# EAGLE schematic EEZ DIB MIO168 r2B5 (EAGLE 7.2.0)
Assembly variants: Farnell, TME

## Sheet 1 of 6: DIB interface
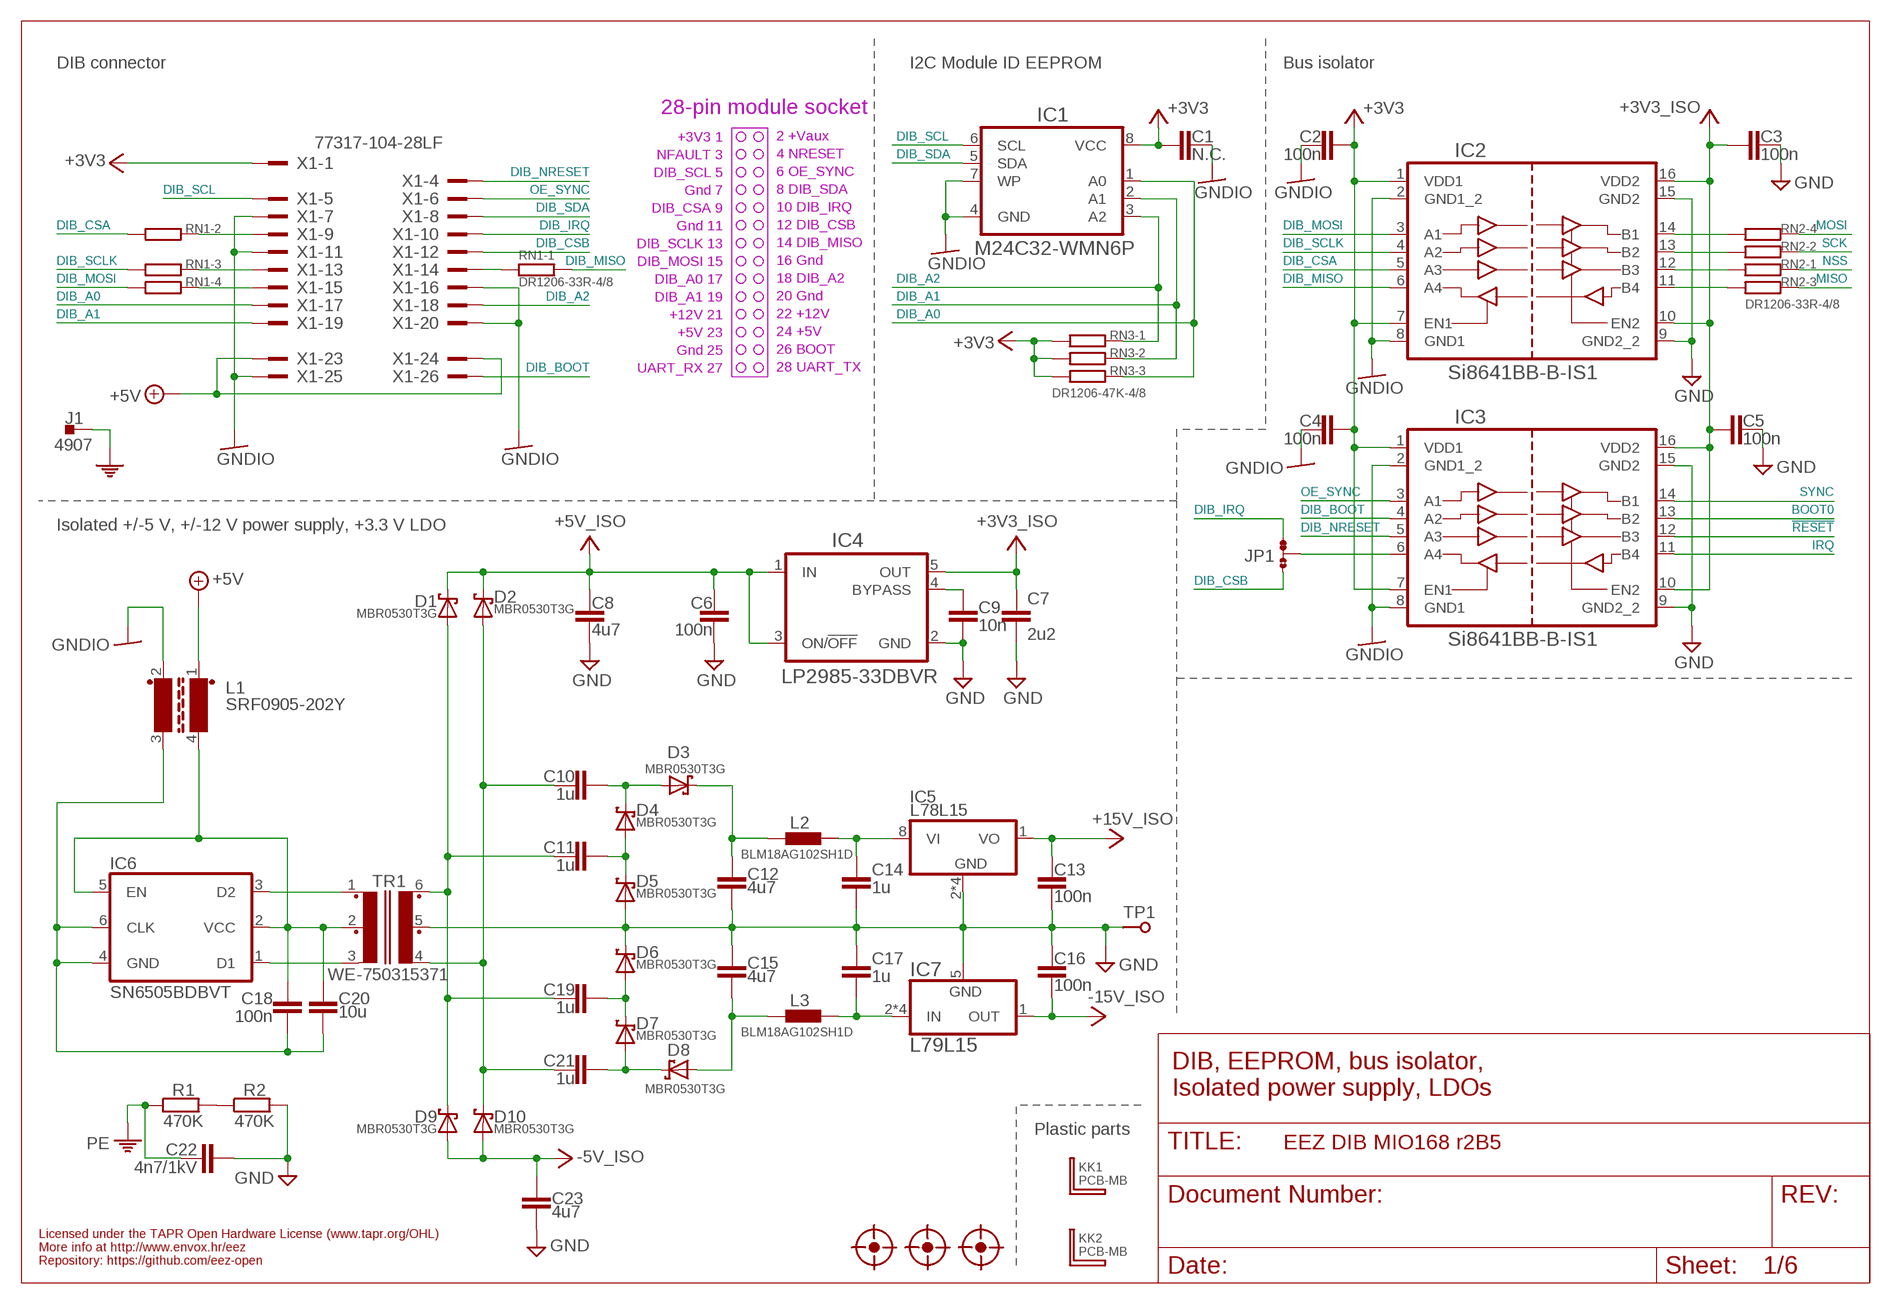
[diagram p0: schematic, sheet 1]

### Parts
C1  N.C.  C-EUC0603  [C0603]
C2  100n  C-EUC0603  [C0603]
C3  100n  C-EUC0603  [C0603]
C4  100n  C-EUC0603  [C0603]
C5  100n  C-EUC0603  [C0603]
C6  100n  C-EUC0603  [C0603]
C7  2u2  C-EUC0805  [C0805]
C8  4u7  C-EUC0805  [C0805]
C9  10n  C-EUC0805  [C0805]
C10  1u  C-EUC0805  [C0805]
C11  1u  C-EUC0805  [C0805]
C12  4u7  C-EUC0805  [C0805]
C13  100n  C-EUC0603  [C0603]
C14  1u  C-EUC0805  [C0805]
C15  4u7  C-EUC0805  [C0805]
C16  100n  C-EUC0603  [C0603]
C17  1u  C-EUC0805  [C0805]
C18  100n  C-EUC0603  [C0603]
C19  1u  C-EUC0805  [C0805]
C20  10u  C-EUC1206  [C1206]
C21  1u  C-EUC0805  [C0805]
C22  4n7/1kV  C-EUC1812  [C1812]
C23  4u7  C-EUC0805  [C0805]
D1  MBR0530T3G  SCHOTTKYSOD123  [SOD123]
D2  MBR0530T3G  SCHOTTKYSOD123  [SOD123]
D3  MBR0530T3G  SCHOTTKYSOD123  [SOD123]
D4  MBR0530T3G  SCHOTTKYSOD123  [SOD123]
D5  MBR0530T3G  SCHOTTKYSOD123  [SOD123]
D6  MBR0530T3G  SCHOTTKYSOD123  [SOD123]
D7  MBR0530T3G  SCHOTTKYSOD123  [SOD123]
D8  MBR0530T3G  SCHOTTKYSOD123  [SOD123]
D9  MBR0530T3G  SCHOTTKYSOD123  [SOD123]
D10  MBR0530T3G  SCHOTTKYSOD123  [SOD123]
FM1  FIDUCIAL_2  [FIDUCIAL_DUAL]
FM2  FIDUCIAL_2  [FIDUCIAL_DUAL]
FM3  FIDUCIAL_2  [FIDUCIAL_DUAL]
IC1  M24C32-WMN6P  AT24CXXSOIC8  [SOIC127P600X173-8N]
IC2  Si8641BB-B-IS1  SI8641NSOIC-16  [SOIC-16]
IC3  Si8641BB-B-IS1  SI8641NSOIC-16  [SOIC-16]
IC4  LP2985-33DBVR  LP2985  [SOT95P270X145-5N]
IC5  L78L15  MC78LXXSOIC8  [SOIC127P600X173-8N]
IC6  SN6505BDBVT  [DBV0006A_N]
IC7  L79L15  MC79LXXSOIC  [SOIC127P600X173-8N]
J1  4907  PCB_TAB-4907  [PCB_TAB-4907]
JP1  JP3-CUT-0805-ROTATED  [JP3-0805-CUT2]
KK1  PCB-MB  [PCB-MB]
KK2  PCB-MB  [PCB-MB]
L1  SRF0905-202Y  SRF0905  [SRF0905]
L2  BLM18AG102SH1D  FERRITE_BEAD0603  [BEAD0603]
L3  BLM18AG102SH1D  FERRITE_BEAD0603  [BEAD0603]
R1  470K  R-EU_R0805  [R0805]
R2  470K  R-EU_R0805  [R0805]
RN1  DR1206-33R-4/8  R_ARRAY4  [CAY16]
RN2  DR1206-33R-4/8  R_ARRAY4  [CAY16]
RN3  DR1206-47K-4/8  R_ARRAY4  [CAY16]
TP1  PCB_TEST_TABSHIELD  [PCB_SHIELD_TAB]
TR1  WE-750315371  MURATA_78615  [MURATA_78615]
X1  77317-104-28LF  [77317-104-28LF]

### Nets
!RESET: IC3.12(B3) ; also sheet 2,4,6
+3V3: C1.2 C2.1 C4.1 IC1.8(VCC) IC2.1(VDD1) IC2.7(EN1) IC3.1(VDD1) IC3.7(EN1) RN3.6 RN3.7 RN3.8 X1.1
+3V3_ISO: C3.2 C5.2 C7.1 IC2.10(EN2) IC2.16(VDD2) IC3.10(EN2) IC3.16(VDD2) IC4.5(OUT) ; also sheet 2,3,4,5,6
+5V: L1.1 X1.23 X1.24
+5V_ISO: C6.1 C8.2 D1.C D2.C IC4.1(IN) IC4.3(ON/!OFF) ; also sheet 6
+15V_ISO: C13.1 IC5.1(VO) ; also sheet 3,4,6
-5V_ISO: C23.2 D9.A D10.A ; also sheet 6
-15V_IN: C17.1 IC7.2(IN) IC7.3(IN) IC7.6(IN) IC7.7(IN) L3.P$2
-15V_ISO: C16.2 IC7.1(OUT) ; also sheet 3,4,6
BOOT0: IC3.13(B2) ; also sheet 2
DIB_A0: IC1.1(A0) RN3.3 X1.17
DIB_A1: IC1.2(A1) RN3.2 X1.19
DIB_A2: IC1.3(A2) RN3.1 X1.18
DIB_BOOT: IC3.4(A2) X1.26
DIB_CSA: IC2.5(A3) RN1.2
DIB_CSB: JP1.NO X1.12
DIB_IRQ: JP1.NC X1.10
DIB_MISO: IC2.6(A4) RN1.1
DIB_MOSI: IC2.3(A1) RN1.4
DIB_NRESET: IC3.5(A3) X1.4
DIB_SCL: IC1.6(SCL) X1.5
DIB_SCLK: IC2.4(A2) RN1.3
DIB_SDA: IC1.5(SDA) X1.8
GND: C3.1 C5.1 C6.2 C7.2 C8.1 C9.1 C12.2 C13.2 C14.1 C15.1 C16.1 C17.2 C22.2 C23.1 D5.A D6.C IC2.9(GND2_2) IC2.15(GND2) IC3.9(GND2_2) IC3.15(GND2) IC4.2(GND) IC5.2(GND) IC5.3(GND) IC5.6(GND) IC5.7(GND) IC7.5(GND) R2.2 TP1.1 TR1.5 ; also sheet 2,3,4,5,6
GNDIO: C1.1 C2.2 C4.2 IC1.4(GND) IC1.7(WP) IC2.2(GND1_2) IC2.8(GND1) IC3.2(GND1_2) IC3.8(GND1) L1.2 X1.7 X1.11 X1.16 X1.20 X1.25
IRQ: IC3.11(B4) ; also sheet 2
MISO: RN2.6 ; also sheet 2
MOSI: RN2.5 ; also sheet 2
N$11: IC3.6(A4) JP1.COM
N$12: IC2.14(B1) RN2.4
N$21: R1.2 R2.1
N$52: C11.1 D4.A D5.C
N$53: IC6.3(D2) TR1.1
N$63: IC6.1(D1) TR1.3
N$64: C11.2 C19.2 D1.A D9.C TR1.6
N$69: RN1.7 X1.9
N$70: C10.2 C21.2 D2.A D10.C TR1.4
N$72: IC2.11(B4) RN2.3
N$79: C10.1 D3.A D4.C
N$99: RN1.6 X1.13
N$101: RN1.8 X1.14
N$102: RN1.5 X1.15
N$104: C19.1 D6.A D7.C
N$105: C21.1 D7.A D8.C
N$106: C9.2 IC4.4(BYPASS)
N$111: C14.2 IC5.8(VI) L2.P$2
N$116: IC2.13(B2) RN2.2
N$118: IC2.12(B3) RN2.1
N$167: C15.2 D8.A L3.P$1
N$169: C12.1 D3.C L2.P$1
NSS: RN2.8 ; also sheet 2
OE_SYNC: IC3.3(A1) X1.6
PE: C22.1 J1.1 J1.2 R1.1
SCK: RN2.7 ; also sheet 2
SN_GND: C18.2 C20.1 IC6.4(GND) IC6.6(CLK) L1.3
SN_VCC: C18.1 C20.2 IC6.2(VCC) IC6.5(EN) L1.4 TR1.2
SYNC: IC3.14(B1) ; also sheet 2
Unconnected: RN3.4 RN3.5 X1.2 X1.3 X1.21 X1.22 X1.27 X1.28

### Notes on the sheet
- DIB connector | I2C Module ID EEPROM | Bus isolator
- 28-pin module socket
- +3V3 1
- 2 +Vaux
- NFAULT 3
- 4 NRESET
- DIB_SCL 5
- 6 OE_SYNC
- Gnd 7
- 8 DIB_SDA
- DIB_CSA 9
- 10 DIB_IRQ
- Gnd 11
- 12 DIB_CSB
- DIB_SCLK 13
- 14 DIB_MISO
- DIB_MOSI 15
- 16 Gnd
- DIB_A0 17
- 18 DIB_A2
- DIB_A1 19
- 20 Gnd
- +12V 21
- 22 +12V
- +5V 23
- 24 +5V
- Gnd 25
- 26 BOOT
- UART_RX 27
- 28 UART_TX
- Isolated +/-5 V, +/-12 V power supply, +3.3 V LDO
- DIB, EEPROM, bus isolator,
  Isolated power supply, LDOs
- Plastic parts
- Licensed under the TAPR Open Hardware License (www.tapr.org/OHL)
- More info at http://www.envox.hr/eez
- Repository: https://github.com/eez-open

## Sheet 2 of 6: MCU
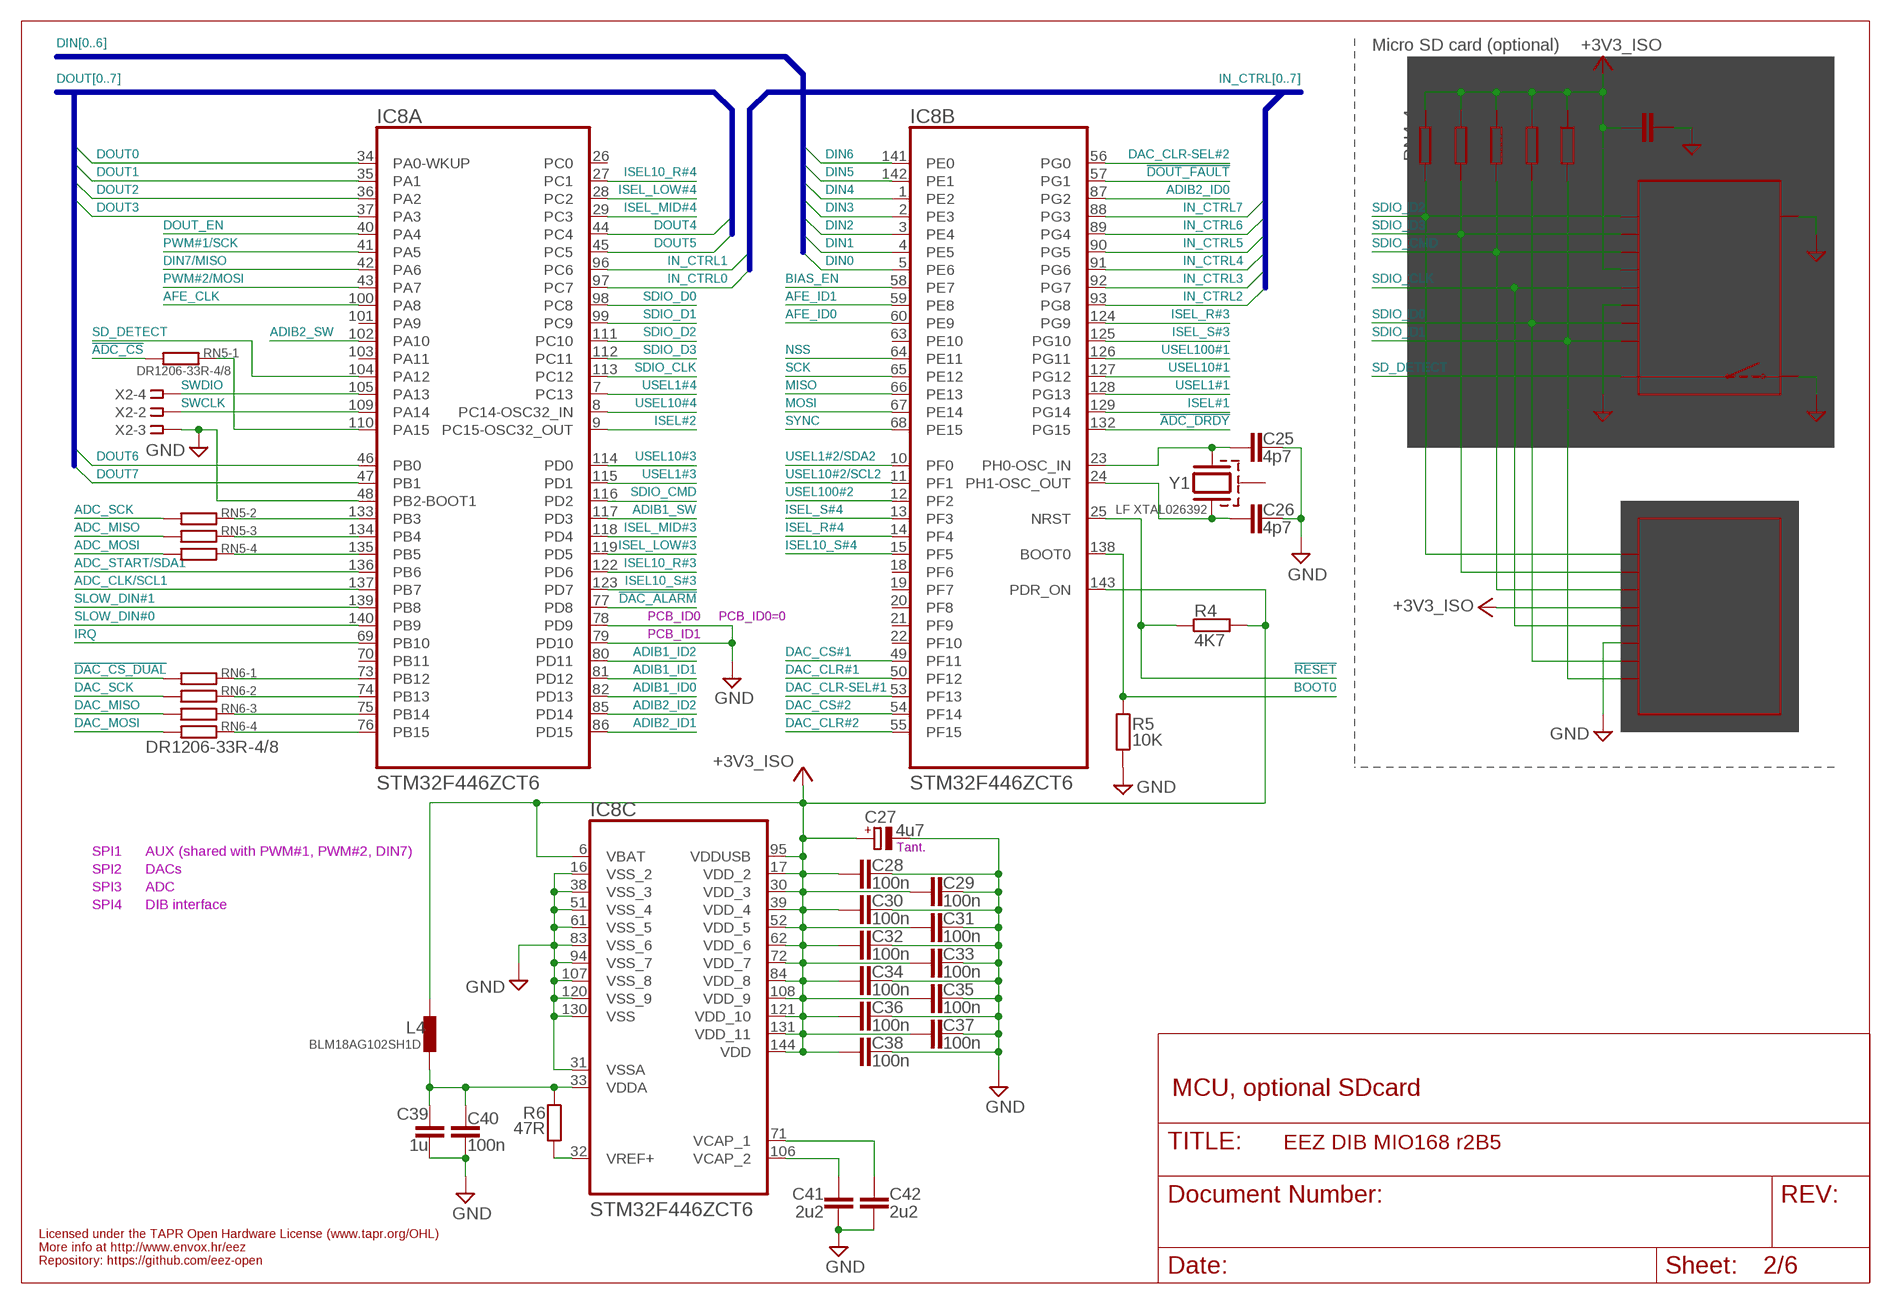
[diagram p1: schematic, sheet 2]

### Parts
C24  N.C.  C-EUC0805  [C0805]
C25  4p7  C-EUC0603  [C0603]
C26  4p7  C-EUC0603  [C0603]
C27  4u7  ECAP1206  [EC1206]
C28  100n  C-EUC0603  [C0603]
C29  100n  C-EUC0603  [C0603]
C30  100n  C-EUC0603  [C0603]
C31  100n  C-EUC0603  [C0603]
C32  100n  C-EUC0603  [C0603]
C33  100n  C-EUC0603  [C0603]
C34  100n  C-EUC0603  [C0603]
C35  100n  C-EUC0603  [C0603]
C36  100n  C-EUC0603  [C0603]
C37  100n  C-EUC0603  [C0603]
C38  100n  C-EUC0603  [C0603]
C39  1u  C-EUC0805  [C0805]
C40  100n  C-EUC0603  [C0603]
C41  2u2  C-EUC0805  [C0805]
C42  2u2  C-EUC0805  [C0805]
IC8  STM32F446ZCT6  [LQFP-144]
IC9  N.C.  XTSD0XG  [LGA8]
J2  N.C.  5033981892  [5033981892]
L4  BLM18AG102SH1D  FERRITE_BEAD0603  [BEAD0603]
R3  N.C.  R-EU_R0805  [R0805]
R4  4K7  R-EU_R0805  [R0805]
R5  10K  R-EU_R0805  [R0805]
R6  47R  R-EU_R0805  [R0805]
RN4  N.C.  R_ARRAY4  [CAY16]
RN5  DR1206-33R-4/8  R_ARRAY4  [CAY16]
RN6  DR1206-33R-4/8  R_ARRAY4  [CAY16]
X2  N.C.  SSW-106-02-S-S  [SSW-106-02-S-S]
Y1  LF XTAL026392  12SMX-B  [12SMX(B)]

### Nets
!ADC_CS: RN5.1 ; also sheet 6
!ADC_DRDY: IC8.132(B:PG15) ; also sheet 6
!DAC_ALARM: IC8.77(A:PD8) ; also sheet 3
!DAC_CS_DUAL: RN6.1 ; also sheet 4
!DOUT_FAULT: IC8.57(B:PG1) ; also sheet 4
!RESET: IC8.25(B:NRST) R4.2 ; also sheet 1,4,6
+3V3_ISO: C24.1 C27.+ C28.1 C29.1 C30.1 C31.1 C32.1 C33.1 C34.1 C35.1 C36.1 C37.1 C38.1 IC8.6(C:VBAT) IC8.17(C:VDD_2) IC8.30(C:VDD_3) IC8.39(C:VDD_4) IC8.52(C:VDD_5) IC8.62(C:VDD_6) IC8.72(C:VDD_7) IC8.84(C:VDD_8) IC8.95(C:VDDUSB) IC8.108(C:VDD_9) IC8.121(C:VDD_10) IC8.131(C:VDD_11) IC8.143(B:PDR_ON) IC8.144(C:VDD) IC9.8(VDD) J2.4(VDD) L4.P$1 R3.1 R4.1 RN4.1 RN4.2 RN4.3 RN4.4 ; also sheet 1,3,4,5,6
ADC_CLK/SCL1: IC8.137(A:PB7) ; also sheet 6
ADC_MISO: RN5.3 ; also sheet 6
ADC_MOSI: RN5.4 ; also sheet 6
ADC_SCK: RN5.2 ; also sheet 6
ADC_START/SDA1: IC8.136(A:PB6) ; also sheet 6
ADIB1_ID0: IC8.82(A:PD13) ; also sheet 6
ADIB1_ID1: IC8.81(A:PD12) ; also sheet 6
ADIB1_ID2: IC8.80(A:PD11) ; also sheet 6
ADIB1_SW: IC8.117(A:PD3) ; also sheet 6
ADIB2_ID0: IC8.87(B:PG2) ; also sheet 6
ADIB2_ID1: IC8.86(A:PD15) ; also sheet 6
ADIB2_ID2: IC8.85(A:PD14) ; also sheet 6
ADIB2_SW: IC8.102(A:PA10) ; also sheet 6
AFE_CLK: IC8.100(A:PA8) ; also sheet 6
AFE_ID0: IC8.60(B:PE9) ; also sheet 6
AFE_ID1: IC8.59(B:PE8) ; also sheet 6
BIAS_EN: IC8.58(B:PE7) ; also sheet 6
BOOT0: IC8.138(B:BOOT0) R5.2 ; also sheet 1
DAC_CLR#1: IC8.50(B:PF12) ; also sheet 3
DAC_CLR#2: IC8.55(B:PF15) ; also sheet 3
DAC_CLR-SEL#1: IC8.53(B:PF13) ; also sheet 3
DAC_CLR-SEL#2: IC8.56(B:PG0) ; also sheet 3
DAC_CS#1: IC8.49(B:PF11) ; also sheet 3
DAC_CS#2: IC8.54(B:PF14) ; also sheet 3
DAC_MISO: RN6.3 ; also sheet 3
DAC_MOSI: RN6.4 ; also sheet 3,4
DAC_SCK: RN6.2 ; also sheet 3,4
DIN0: IC8.5(B:PE6) ; also sheet 5
DIN1: IC8.4(B:PE5) ; also sheet 5
DIN2: IC8.3(B:PE4) ; also sheet 5
DIN3: IC8.2(B:PE3) ; also sheet 5
DIN4: IC8.1(B:PE2) ; also sheet 5
DIN5: IC8.142(B:PE1) ; also sheet 5
DIN6: IC8.141(B:PE0) ; also sheet 5
DIN7/MISO: IC8.42(A:PA6) ; also sheet 5
DOUT0: IC8.34(A:PA0-WKUP) ; also sheet 4
DOUT1: IC8.35(A:PA1) ; also sheet 4
DOUT2: IC8.36(A:PA2) ; also sheet 4
DOUT3: IC8.37(A:PA3) ; also sheet 4
DOUT4: IC8.44(A:PC4) ; also sheet 4
DOUT5: IC8.45(A:PC5) ; also sheet 4
DOUT6: IC8.46(A:PB0) ; also sheet 4
DOUT7: IC8.47(A:PB1) ; also sheet 4
DOUT_EN: IC8.40(A:PA4) ; also sheet 4,6
GND: C24.2 C25.1 C26.1 C27.- C28.2 C29.2 C30.2 C31.2 C32.2 C33.2 C34.2 C35.2 C36.2 C37.2 C38.2 C39.2 C40.2 C41.1 C42.1 IC8.16(C:VSS_2) IC8.31(C:VSSA) IC8.38(C:VSS_3) IC8.48(A:PB2-BOOT1) IC8.51(C:VSS_4) IC8.61(C:VSS_5) IC8.78(A:PD9) IC8.79(A:PD10) IC8.83(C:VSS_6) IC8.94(C:VSS_7) IC8.107(C:VSS_8) IC8.120(C:VSS_9) IC8.130(C:VSS) IC9.4(VSS) J2.6(VSS) J2.S1(SH) J2.S2(SH) J2.S(SH) J2.SW2 R5.1 X2.3 ; also sheet 1,3,4,5,6
IN_CTRL0: IC8.97(A:PC7) ; also sheet 5
IN_CTRL1: IC8.96(A:PC6) ; also sheet 5
IN_CTRL2: IC8.93(B:PG8) ; also sheet 5
IN_CTRL3: IC8.92(B:PG7) ; also sheet 5
IN_CTRL4: IC8.91(B:PG6) ; also sheet 5
IN_CTRL5: IC8.90(B:PG5) ; also sheet 5
IN_CTRL6: IC8.89(B:PG4) ; also sheet 5
IN_CTRL7: IC8.88(B:PG3) ; also sheet 5
IRQ: IC8.69(A:PB10) ; also sheet 1
ISEL10_R#3: IC8.122(A:PD6) ; also sheet 6
ISEL10_R#4: IC8.27(A:PC1) ; also sheet 6
ISEL10_S#3: IC8.123(A:PD7) ; also sheet 6
ISEL10_S#4: IC8.15(B:PF5) ; also sheet 6
ISEL#1: IC8.129(B:PG14) ; also sheet 6
ISEL#2: IC8.9(A:PC15-OSC32_OUT) ; also sheet 6
ISEL_LOW#3: IC8.119(A:PD5) ; also sheet 6
ISEL_LOW#4: IC8.28(A:PC2) ; also sheet 6
ISEL_MID#3: IC8.118(A:PD4) ; also sheet 6
ISEL_MID#4: IC8.29(A:PC3) ; also sheet 6
ISEL_R#3: IC8.124(B:PG9) ; also sheet 6
ISEL_R#4: IC8.14(B:PF4) ; also sheet 6
ISEL_S#3: IC8.125(B:PG10) ; also sheet 6
ISEL_S#4: IC8.13(B:PF3) ; also sheet 6
MISO: IC8.66(B:PE13) ; also sheet 1
MOSI: IC8.67(B:PE14) ; also sheet 1
N$27: IC8.110(A:PA15) RN5.8
N$29: IC8.133(A:PB3) RN5.7
N$34: IC8.134(A:PB4) RN5.6
N$97: C41.2 IC8.106(C:VCAP_2)
N$100: IC8.135(A:PB5) RN5.5
N$113: C42.2 IC8.71(C:VCAP_1)
N$115: C39.1 C40.1 IC8.33(C:VDDA) L4.P$2 R6.1
N$121: IC8.32(C:VREF+) R6.2
N$176: IC8.73(A:PB12) RN6.8
N$177: IC8.74(A:PB13) RN6.7
N$178: IC8.75(A:PB14) RN6.6
N$179: IC8.76(A:PB15) RN6.5
NSS: IC8.64(B:PE11) ; also sheet 1
PWM#1/SCK: IC8.41(A:PA5) ; also sheet 6
PWM#2/MOSI: IC8.43(A:PA7) ; also sheet 6
RCC_OSC_IN: C25.2 IC8.23(B:PH0-OSC_IN) Y1.3
RCC_OSC_OUT: C26.2 IC8.24(B:PH1-OSC_OUT) Y1.1
SCK: IC8.65(B:PE12) ; also sheet 1
SD_DETECT: IC8.104(A:PA12) J2.SW1
SDIO_CLK: IC8.113(A:PC12) IC9.3(CLK) J2.5(CLK)
SDIO_CMD: IC8.116(A:PD2) IC9.5(CMD) J2.3(CMD) RN4.7
SDIO_D0: IC8.98(A:PC8) IC9.6(DAT0) J2.7(DAT0) RN4.8
SDIO_D1: IC8.99(A:PC9) IC9.7(DAT1) J2.8(DAT1) R3.2
SDIO_D2: IC8.111(A:PC10) IC9.1(DAT2) J2.1(DAT2) RN4.5
SDIO_D3: IC8.112(A:PC11) IC9.2(CD/DAT3) J2.2(CD/DAT3) RN4.6
SLOW_DIN#0: IC8.140(A:PB9) ; also sheet 5
SLOW_DIN#1: IC8.139(A:PB8) ; also sheet 5
SWCLK: IC8.109(A:PA14) X2.2
SWDIO: IC8.105(A:PA13) X2.4
SYNC: IC8.68(B:PE15) ; also sheet 1
USEL1#1: IC8.128(B:PG13) ; also sheet 6
USEL1#2/SDA2: IC8.10(B:PF0) ; also sheet 6
USEL1#3: IC8.115(A:PD1) ; also sheet 6
USEL1#4: IC8.7(A:PC13) ; also sheet 6
USEL10#1: IC8.127(B:PG12) ; also sheet 6
USEL10#2/SCL2: IC8.11(B:PF1) ; also sheet 6
USEL10#3: IC8.114(A:PD0) ; also sheet 6
USEL10#4: IC8.8(A:PC14-OSC32_IN) ; also sheet 6
USEL100#1: IC8.126(B:PG11) ; also sheet 6
USEL100#2: IC8.12(B:PF2) ; also sheet 6
Unconnected: IC8.18(B:PF6) IC8.19(B:PF7) IC8.20(B:PF8) IC8.21(B:PF9) IC8.22(B:PF10) IC8.26(A:PC0) IC8.63(B:PE10) IC8.70(A:PB11) IC8.101(A:PA9) IC8.103(A:PA11) X2.1 X2.5 X2.6 Y1.2(GND) Y1.4(GND)

### Buses
DIN[0..6]
DOUT[0..7]
IN_CTRL[0..7]

### Notes on the sheet
- Micro SD card (optional)
- PCB_ID0 | PCB_ID0=0
- PCB_ID1
- Tant.
- SPI1 | AUX (shared with PWM#1, PWM#2, DIN7)
- SPI2 | DACs
- SPI3 | ADC
- SPI4 | DIB interface
- MCU, optional SDcard
- Licensed under the TAPR Open Hardware License (www.tapr.org/OHL)
- More info at http://www.envox.hr/eez
- Repository: https://github.com/eez-open

## Sheet 3 of 6: Voltage/current DACs
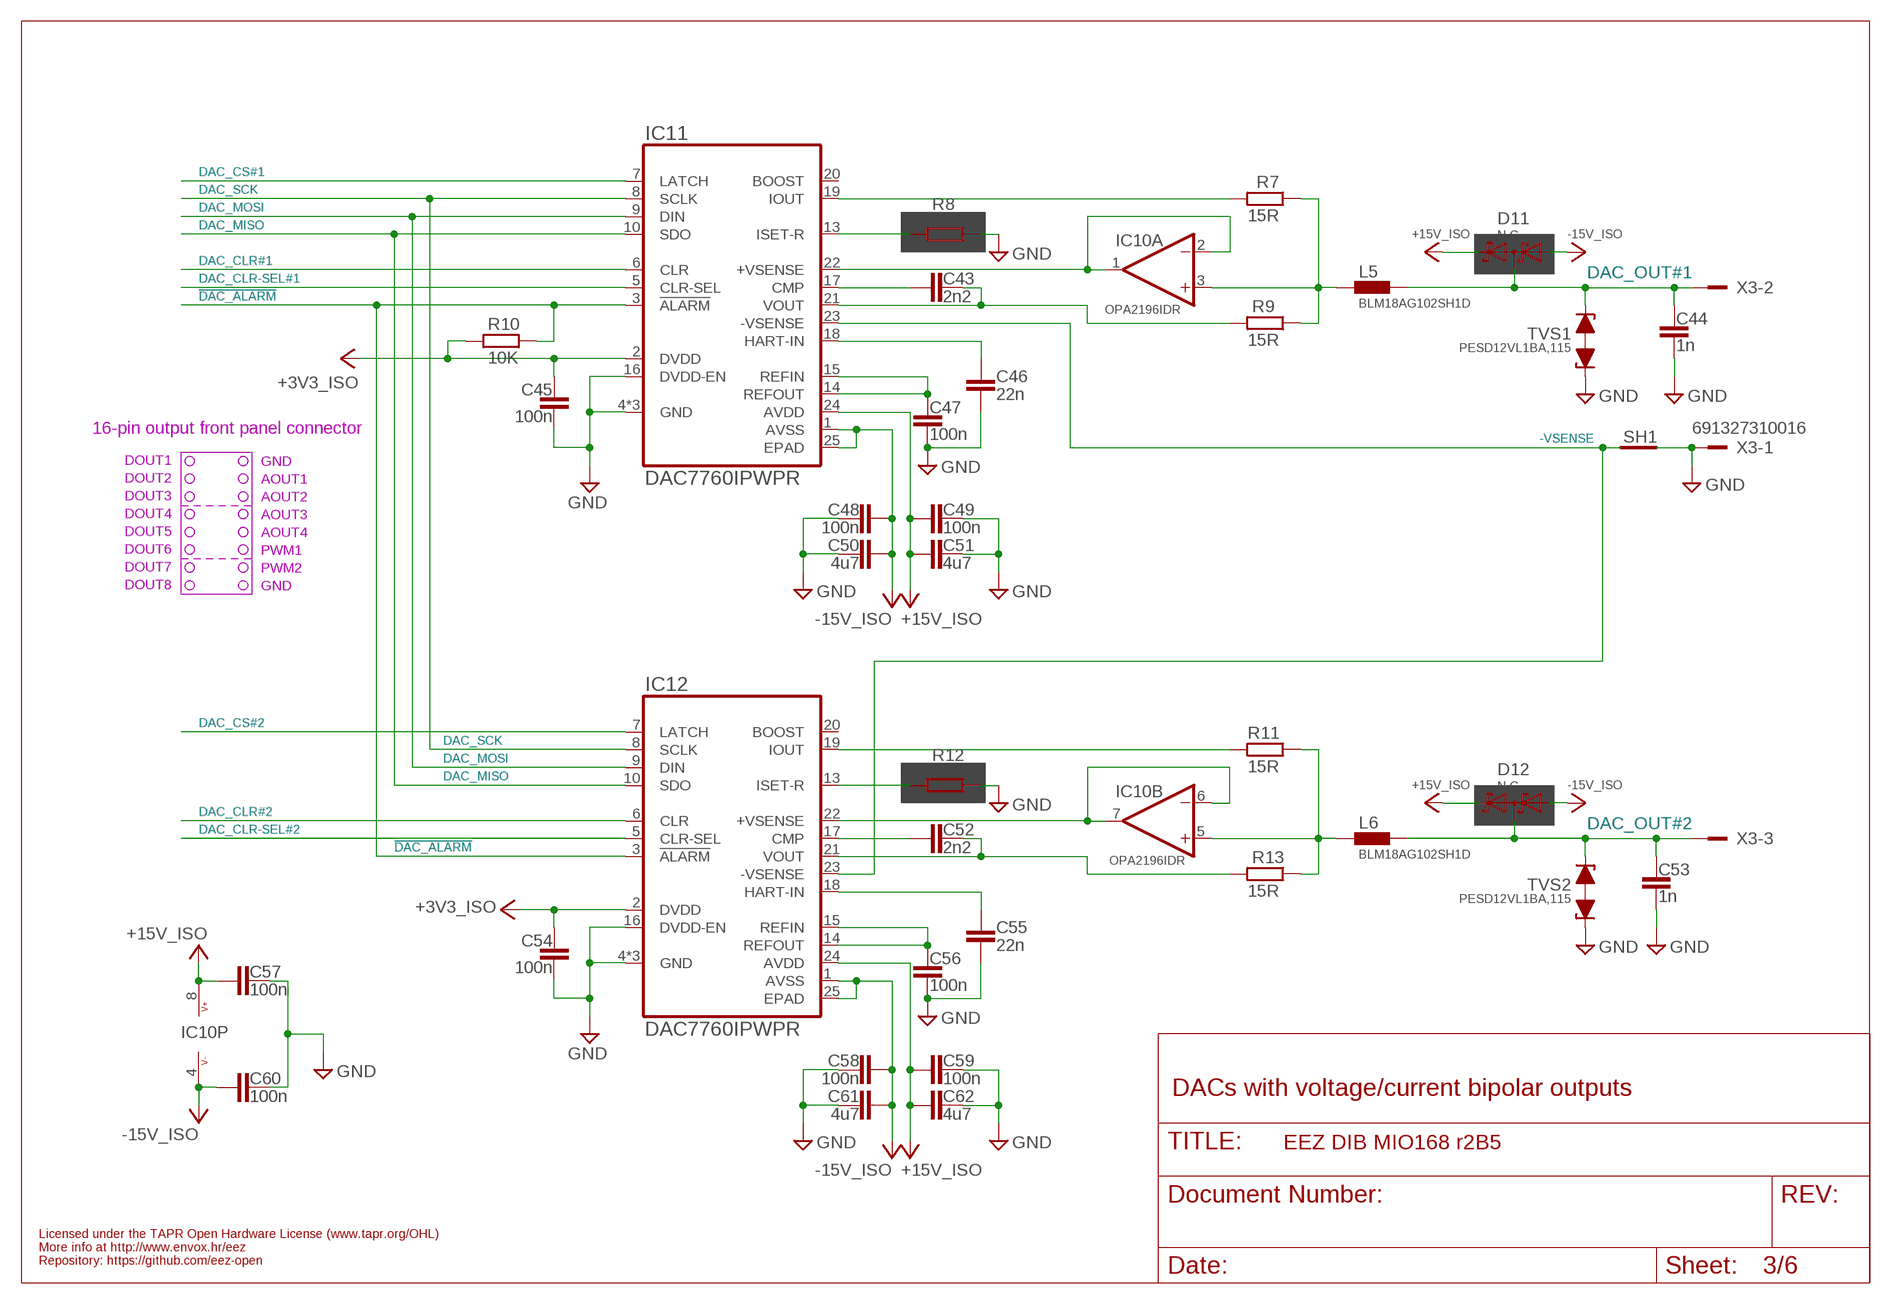
[diagram p2: schematic, sheet 3]

### Parts
C43  2n2  C-EUC0805  [C0805]
C44  1n  C-EUC0805  [C0805]
C45  100n  C-EUC0603  [C0603]
C46  22n  C-EUC0805  [C0805]
C47  100n  C-EUC0603  [C0603]
C48  100n  C-EUC0603  [C0603]
C49  100n  C-EUC0603  [C0603]
C50  4u7  C-EUC0805  [C0805]
C51  4u7  C-EUC0805  [C0805]
C52  2n2  C-EUC0805  [C0805]
C53  1n  C-EUC0805  [C0805]
C54  100n  C-EUC0603  [C0603]
C55  22n  C-EUC0805  [C0805]
C56  100n  C-EUC0603  [C0603]
C57  100n  C-EUC0603  [C0603]
C58  100n  C-EUC0603  [C0603]
C59  100n  C-EUC0603  [C0603]
C60  100n  C-EUC0603  [C0603]
C61  4u7  C-EUC0805  [C0805]
C62  4u7  C-EUC0805  [C0805]
D11  N.C.  BAT54S  [SOT23]
D12  N.C.  BAT54S  [SOT23]
IC10  OPA2196IDR  TL072SOIC8  [SOIC127P600X173-8N]
IC11  DAC7760IPWPR  [PWP24]
IC12  DAC7760IPWPR  [PWP24]
L5  BLM18AG102SH1D  FERRITE_BEAD0603  [BEAD0603]
L6  BLM18AG102SH1D  FERRITE_BEAD0603  [BEAD0603]
R7  15R  R-EU_R0805  [R0805]
R8  N.C.  R-EU_R0805  [R0805]
R9  15R  R-EU_R0805  [R0805]
R10  10K  R-EU_R0805  [R0805]
R11  15R  R-EU_R0805  [R0805]
R12  N.C.  R-EU_R0805  [R0805]
R13  15R  R-EU_R0805  [R0805]
SH1  SHORTNOHOLE  [SHORT_NOHOLE]
TVS1  PESD12VL1BA,115  PESDXL1BA  [SOD323-BIDIR]
TVS2  PESD12VL1BA,115  PESDXL1BA  [SOD323-BIDIR]
X3  691327310016  [691327310016]

### Nets
!DAC_ALARM: IC11.3(!ALARM) IC12.3(!ALARM) R10.2 ; also sheet 2
+3V3_ISO: C45.1 C54.1 IC11.2(DVDD) IC12.2(DVDD) R10.1 ; also sheet 1,2,4,5,6
+15V_ISO: C49.1 C51.2 C57.1 C59.1 C62.2 D11.2(C2) D12.2(C2) IC10.8(P:V+) IC11.24(AVDD) IC12.24(AVDD) ; also sheet 1,4,6
+VSENSE1: IC10.1(A:OUT) IC10.2(A:-IN) IC11.22(+VSENSE)
+VSENSE2: IC10.6(B:-IN) IC10.7(B:OUT) IC12.22(+VSENSE)
-15V_ISO: C48.1 C50.2 C58.1 C60.1 C61.2 D11.1(A1) D12.1(A1) IC10.4(P:V-) IC11.1(AVSS) IC11.25(EPAD) IC12.1(AVSS) IC12.25(EPAD) ; also sheet 1,4,6
-VSENSE: IC11.23(-VSENSE) IC12.23(-VSENSE) SH1.2(GND_B) ; also sheet 6
DAC_CLR#1: IC11.6(CLR) ; also sheet 2
DAC_CLR#2: IC12.6(CLR) ; also sheet 2
DAC_CLR-SEL#1: IC11.5(CLR-SEL) ; also sheet 2
DAC_CLR-SEL#2: IC12.5(CLR-SEL) ; also sheet 2
DAC_CS#1: IC11.7(LATCH) ; also sheet 2
DAC_CS#2: IC12.7(LATCH) ; also sheet 2
DAC_MISO: IC11.10(SDO) IC12.10(SDO) ; also sheet 2
DAC_MOSI: IC11.9(DIN) IC12.9(DIN) ; also sheet 2,4
DAC_OUT#1: C44.1 D11.3(C1A2) L5.P$2 TVS1.C2 X3.2 ; also sheet 6
DAC_OUT#2: C53.1 D12.3(C1A2) L6.P$2 TVS2.C2 X3.3 ; also sheet 6
DAC_SCK: IC11.8(SCLK) IC12.8(SCLK) ; also sheet 2,4
GND: C44.2 C45.2 C46.1 C47.2 C48.2 C49.2 C50.1 C51.1 C53.2 C54.2 C55.1 C56.2 C57.2 C58.2 C59.2 C60.2 C61.1 C62.1 IC11.4(GND) IC11.11(GND) IC11.12(GND) IC11.16(DVDD-EN) IC12.4(GND) IC12.11(GND) IC12.12(GND) IC12.16(DVDD-EN) R8.1 R12.1 SH1.1(GND_A) TVS1.C1 TVS2.C1 X3.1 ; also sheet 1,2,4,5,6
HART#1: C46.2 IC11.18(HART-IN)
HART#2: C55.2 IC12.18(HART-IN)
N$19: C52.2 IC12.17(CMP)
N$26: C52.1 IC12.21(VOUT) R13.2
N$43: IC10.5(B:+IN) L6.P$1 R11.1 R13.1
N$45: IC12.19(IOUT) R11.2
N$46: C56.1 IC12.14(REFOUT) IC12.15(REFIN)
N$62: C43.2 IC11.17(CMP)
N$65: IC10.3(A:+IN) L5.P$1 R7.1 R9.1
N$66: C47.1 IC11.14(REFOUT) IC11.15(REFIN)
N$68: IC12.13(ISET-R) R12.2
N$80: IC11.13(ISET-R) R8.2
N$82: C43.1 IC11.21(VOUT) R9.2
N$83: IC11.19(IOUT) R7.2
Unconnected: IC11.20(BOOST) IC12.20(BOOST)

### Notes on the sheet
- 16-pin output front panel connector
- GND
- DOUT1
- AOUT1
- DOUT2
- AOUT2
- DOUT3
- AOUT3
- DOUT4
- AOUT4
- DOUT5
- PWM1
- DOUT6
- PWM2
- DOUT7
- GND
- DOUT8
- DACs with voltage/current bipolar outputs
- Licensed under the TAPR Open Hardware License (www.tapr.org/OHL)
- More info at http://www.envox.hr/eez
- Repository: https://github.com/eez-open

## Sheet 4 of 6: Voltage DAC, Digital outputs
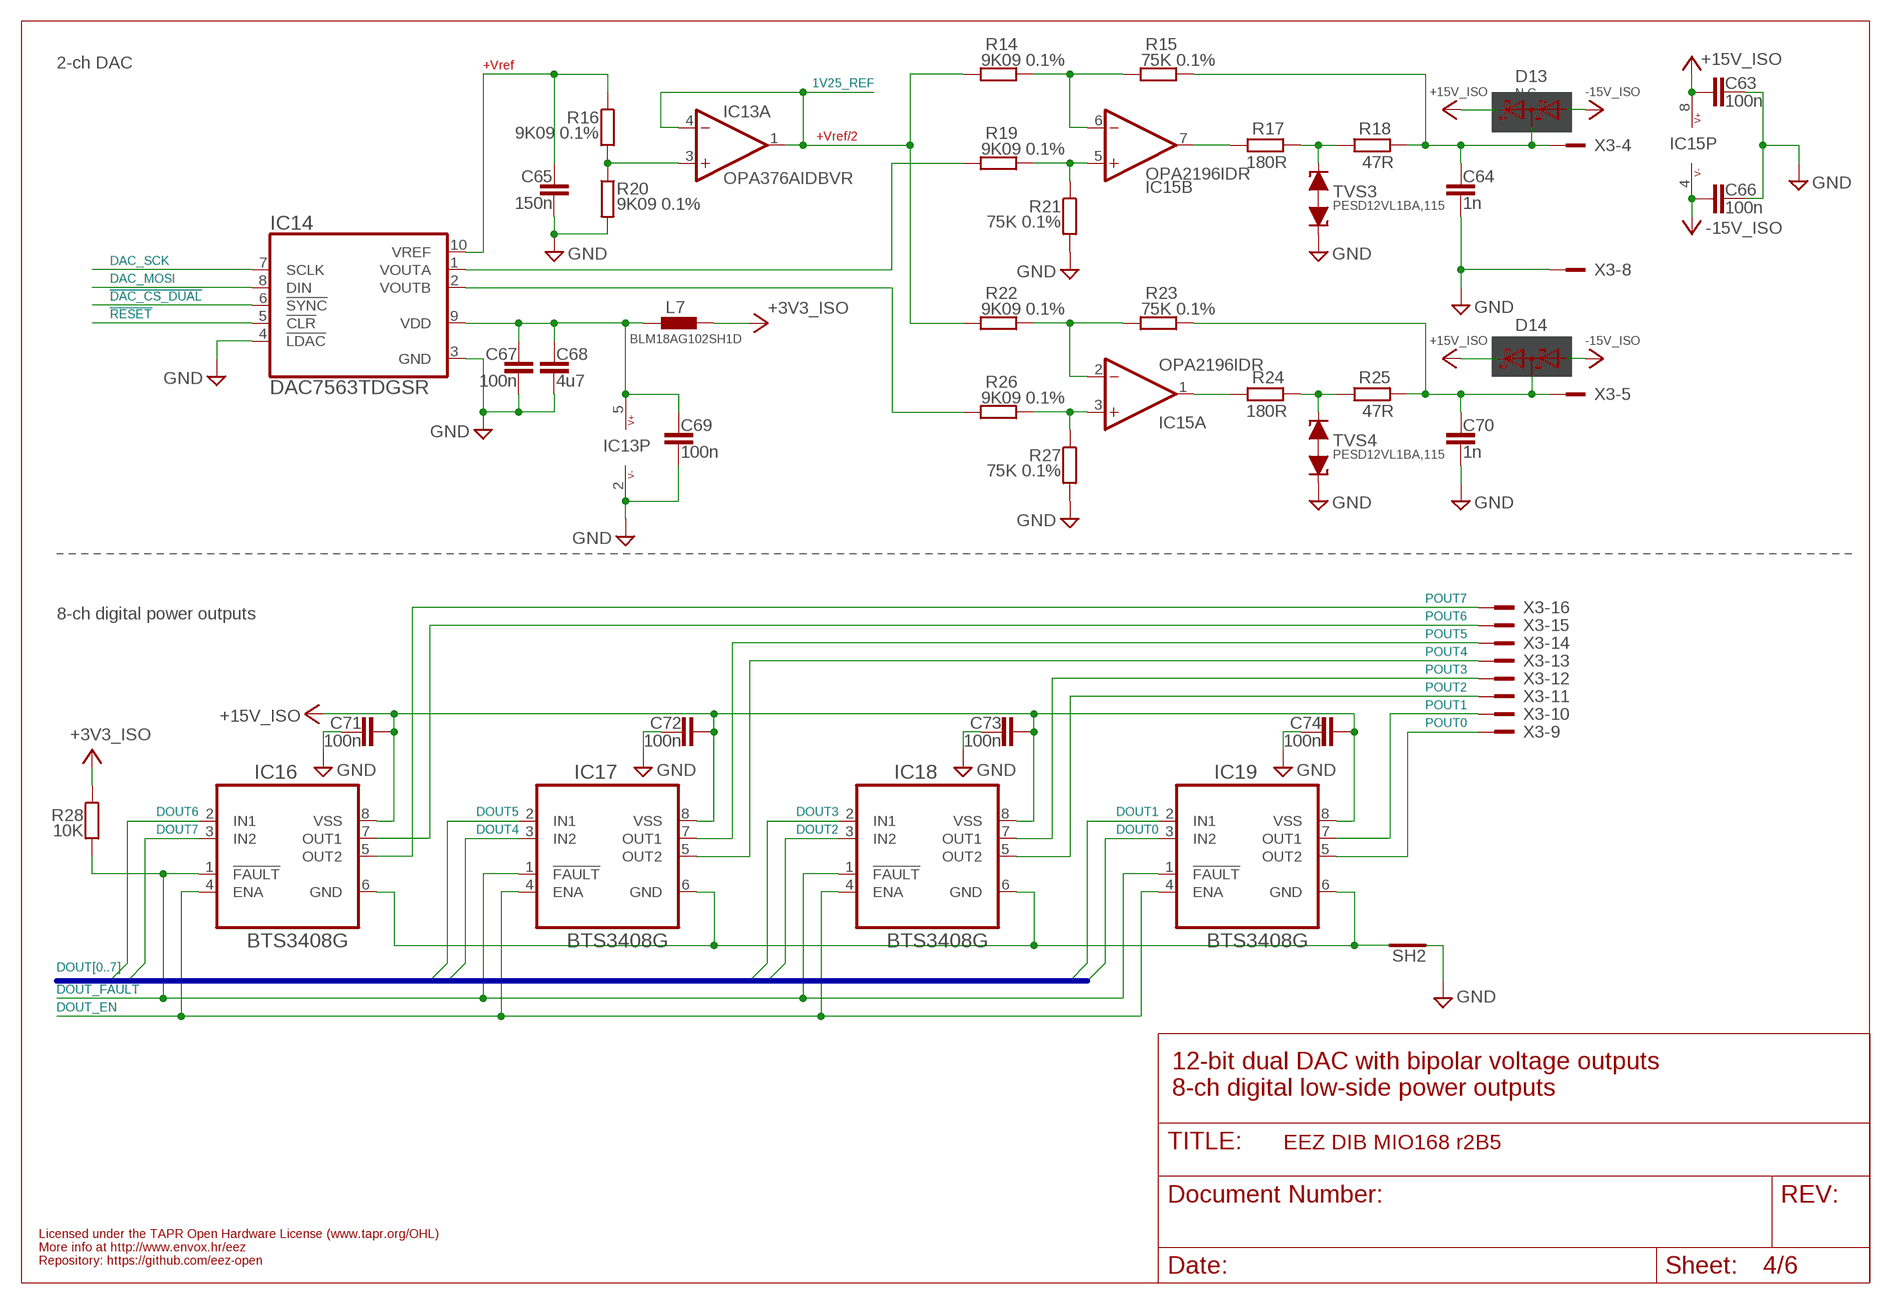
[diagram p3: schematic, sheet 4]

### Parts
C63  100n  C-EUC0603  [C0603]
C64  1n  C-EUC0805  [C0805]
C65  150n  C-EUC0805  [C0805]
C66  100n  C-EUC0603  [C0603]
C67  100n  C-EUC0603  [C0603]
C68  4u7  C-EUC0805  [C0805]
C69  100n  C-EUC0603  [C0603]
C70  1n  C-EUC0805  [C0805]
C71  100n  C-EUC0603  [C0603]
C72  100n  C-EUC0603  [C0603]
C73  100n  C-EUC0603  [C0603]
C74  100n  C-EUC0603  [C0603]
D13  N.C.  BAT54S  [SOT23]
D14  N.C.  BAT54S  [SOT23]
IC13  OPA376AIDBVR  [DBV5]
IC14  DAC7563TDGSR  [DGS10]
IC15  OPA2196IDR  TL072SOIC8  [SOIC127P600X173-8N]
IC16  BTS3408G  [SOIC127P600X173-8N]
IC17  BTS3408G  [SOIC127P600X173-8N]
IC18  BTS3408G  [SOIC127P600X173-8N]
IC19  BTS3408G  [SOIC127P600X173-8N]
L7  BLM18AG102SH1D  FERRITE_BEAD0603  [BEAD0603]
R14  9K09 0.1%  R-EU_R0805  [R0805]
R15  75K 0.1%  R-EU_R0805  [R0805]
R16  9K09 0.1%  R-EU_R0805  [R0805]
R17  180R  R-EU_R0805  [R0805]
R18  47R  R-EU_R0805  [R0805]
R19  9K09 0.1%  R-EU_R0805  [R0805]
R20  9K09 0.1%  R-EU_R0805  [R0805]
R21  75K 0.1%  R-EU_R0805  [R0805]
R22  9K09 0.1%  R-EU_R0805  [R0805]
R23  75K 0.1%  R-EU_R0805  [R0805]
R24  180R  R-EU_R0805  [R0805]
R25  47R  R-EU_R0805  [R0805]
R26  9K09 0.1%  R-EU_R0805  [R0805]
R27  75K 0.1%  R-EU_R0805  [R0805]
R28  10K  R-EU_R0805  [R0805]
SH2  SHORTNOHOLE  [SHORT_NOHOLE]
TVS3  PESD12VL1BA,115  PESDXL1BA  [SOD323-BIDIR]
TVS4  PESD12VL1BA,115  PESDXL1BA  [SOD323-BIDIR]

### Nets
1V25_REF: IC13.1(A:OUT) IC13.4(A:-IN) R14.2 R22.2
2V5_REF: C65.2 IC14.10(VREF) R16.1
!DAC_CS_DUAL: IC14.6(!SYNC) ; also sheet 2
!DOUT_FAULT: IC16.1(!FAULT) IC17.1(!FAULT) IC18.1(!FAULT) IC19.1(!FAULT) R28.2 ; also sheet 2
!RESET: IC14.5(!CLR) ; also sheet 1,2,6
+3V3_ISO: L7.P$2 R28.1 ; also sheet 1,2,3,5,6
+15V_ISO: C63.1 C71.2 C72.2 C73.2 C74.2 D13.2(C2) D14.2(C2) IC15.8(P:V+) IC16.8(VSS) IC17.8(VSS) IC18.8(VSS) IC19.8(VSS) ; also sheet 1,3,6
-15V_ISO: C66.1 D13.1(A1) D14.1(A1) IC15.4(P:V-) ; also sheet 1,3,6
DAC_MOSI: IC14.8(DIN) ; also sheet 2,3
DAC_SCK: IC14.7(SCLK) ; also sheet 2,3
DOUT0: IC19.3(IN2) ; also sheet 2
DOUT1: IC19.2(IN1) ; also sheet 2
DOUT2: IC18.3(IN2) ; also sheet 2
DOUT3: IC18.2(IN1) ; also sheet 2
DOUT4: IC17.3(IN2) ; also sheet 2
DOUT5: IC17.2(IN1) ; also sheet 2
DOUT6: IC16.2(IN1) ; also sheet 2
DOUT7: IC16.3(IN2) ; also sheet 2
DOUT_EN: IC16.4(ENA) IC17.4(ENA) IC18.4(ENA) IC19.4(ENA) ; also sheet 2,6
GND: C63.2 C64.2 C65.1 C66.2 C67.2 C68.1 C69.2 C70.2 C71.1 C72.1 C73.1 C74.1 IC13.2(P:V-) IC14.3(GND) IC14.4(!LDAC) R20.2 R21.2 R27.2 SH2.1(GND_A) TVS3.C1 TVS4.C1 X3.8 ; also sheet 1,2,3,5,6
ISET1: R17.2 R18.1 TVS3.C2
ISET2: R24.2 R25.1 TVS4.C2
N$1: IC16.6(GND) IC17.6(GND) IC18.6(GND) IC19.6(GND) SH2.2(GND_B)
N$54: IC15.5(B:+IN) R19.1 R21.1
N$55: IC15.6(B:-IN) R14.1 R15.2
N$56: IC15.7(B:OUT) R17.1
N$57: IC15.3(A:+IN) R26.1 R27.1
N$58: IC15.2(A:-IN) R22.1 R23.2
N$59: IC15.1(A:OUT) R24.1
N$60: IC13.3(A:+IN) R16.2 R20.1
N$61: IC14.1(VOUTA) R19.2
N$67: IC14.2(VOUTB) R26.2
N$71: C67.1 C68.2 C69.1 IC13.5(P:V+) IC14.9(VDD) L7.P$1
N$73: C70.1 D14.3(C1A2) R23.1 R25.2 X3.5
N$74: C64.1 D13.3(C1A2) R15.1 R18.2 X3.4
POUT0: IC19.5(OUT2) X3.9
POUT1: IC19.7(OUT1) X3.10
POUT2: IC18.5(OUT2) X3.11
POUT3: IC18.7(OUT1) X3.12
POUT4: IC17.5(OUT2) X3.13
POUT5: IC17.7(OUT1) X3.14
POUT6: IC16.7(OUT1) X3.15
POUT7: IC16.5(OUT2) X3.16

### Buses
DOUT[0..7]

### Notes on the sheet
- 2-ch DAC
- +Vref
- +Vref/2
- 8-ch digital power outputs
- 12-bit dual DAC with bipolar voltage outputs
  8-ch digital low-side power outputs
- Licensed under the TAPR Open Hardware License (www.tapr.org/OHL)
- More info at http://www.envox.hr/eez
- Repository: https://github.com/eez-open

## Sheet 5 of 6: Digital inputs
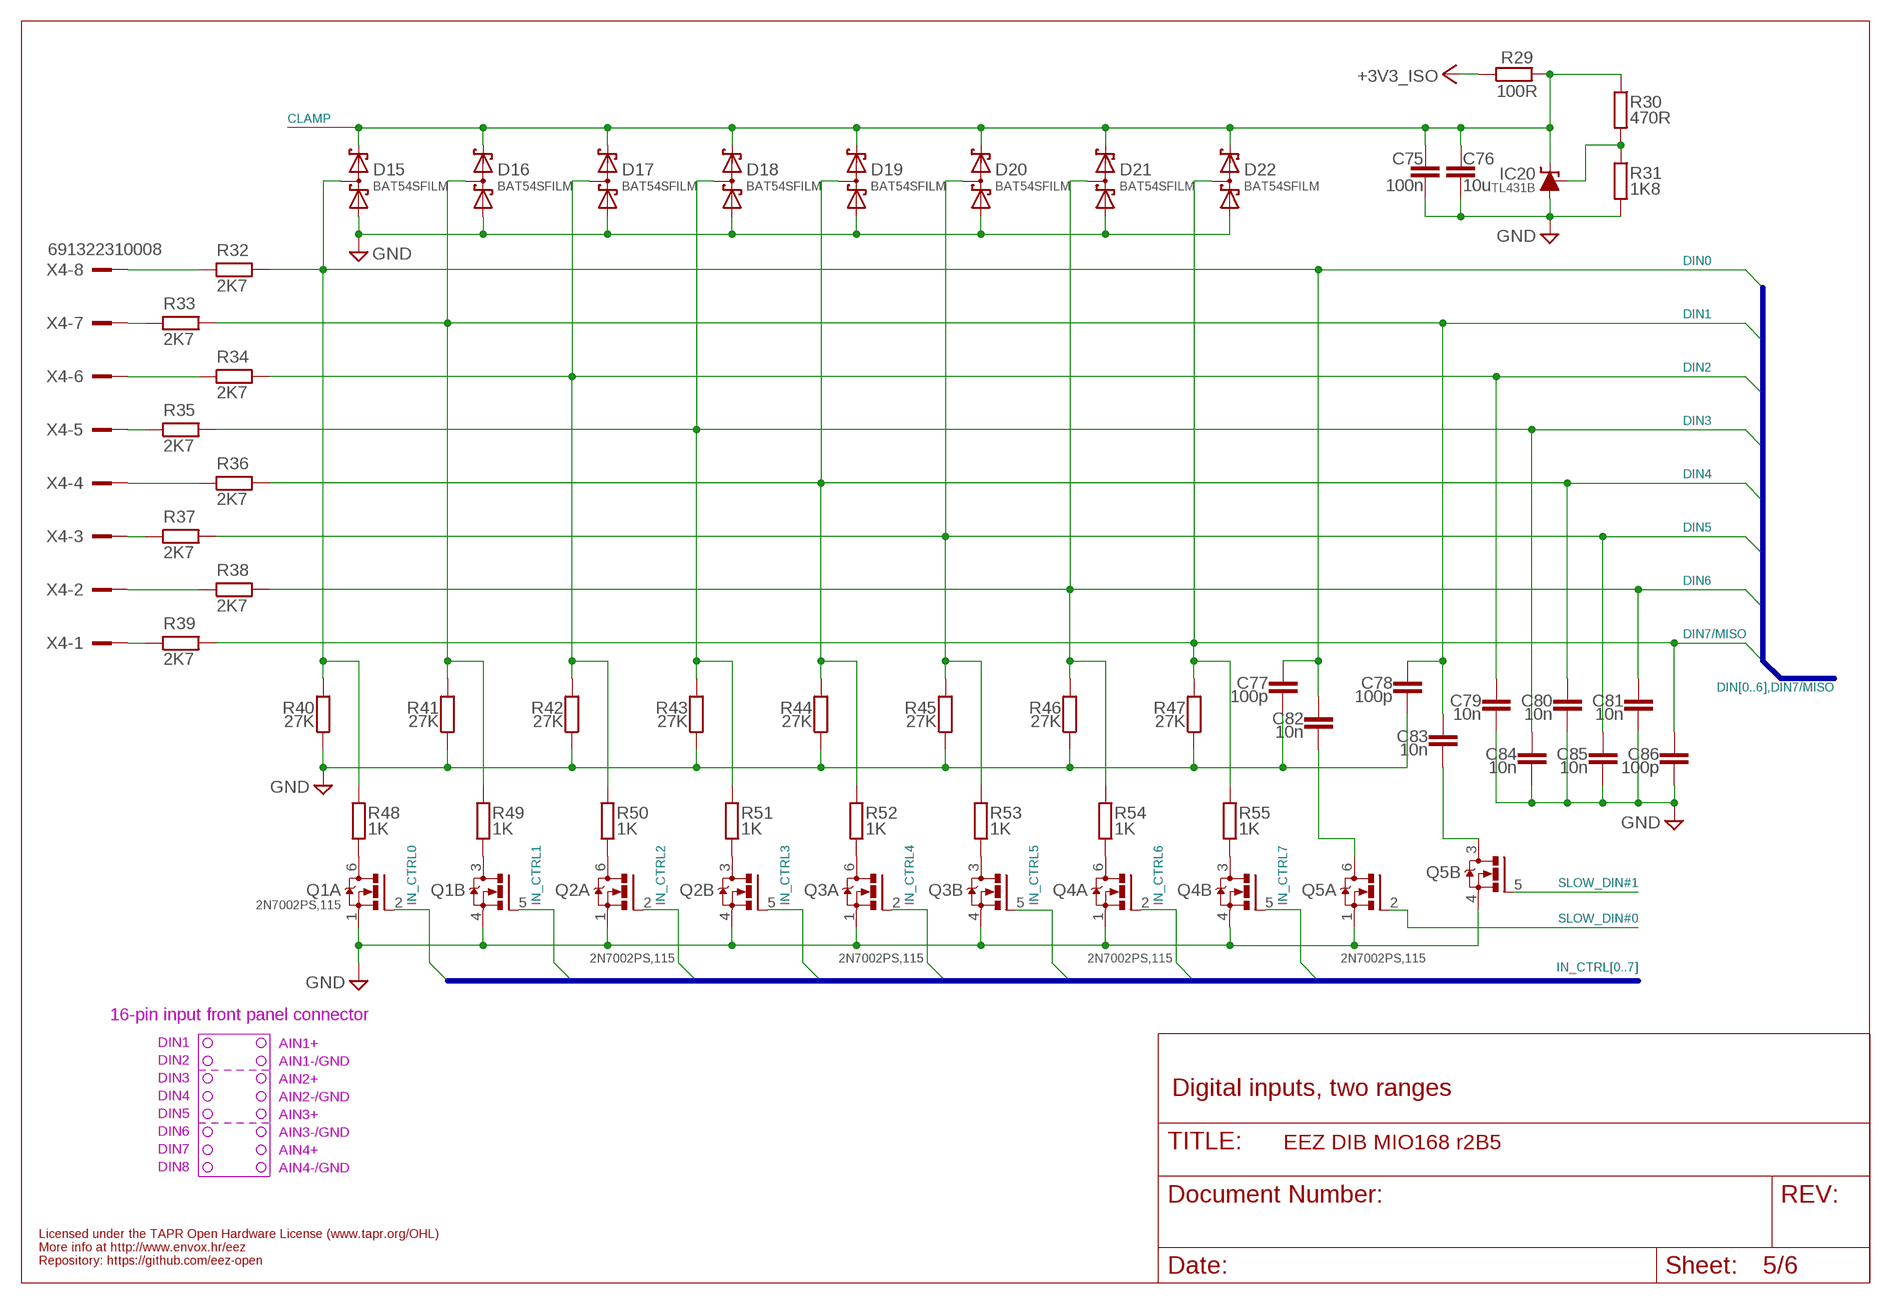
[diagram p4: schematic, sheet 5]

### Parts
C75  100n  C-EUC0603  [C0603]
C76  10u  C-EUC1206  [C1206]
C77  100p  C-EUC0805  [C0805]
C78  100p  C-EUC0805  [C0805]
C79  10n  C-EUC0805  [C0805]
C80  10n  C-EUC0805  [C0805]
C81  10n  C-EUC0805  [C0805]
C82  10n  C-EUC0805  [C0805]
C83  10n  C-EUC0805  [C0805]
C84  10n  C-EUC0805  [C0805]
C85  10n  C-EUC0805  [C0805]
C86  100p  C-EUC0805  [C0805]
D15  BAT54SFILM  BAT54S  [SOT23]
D16  BAT54SFILM  BAT54S  [SOT23]
D17  BAT54SFILM  BAT54S  [SOT23]
D18  BAT54SFILM  BAT54S  [SOT23]
D19  BAT54SFILM  BAT54S  [SOT23]
D20  BAT54SFILM  BAT54S  [SOT23]
D21  BAT54SFILM  BAT54S  [SOT23]
D22  BAT54SFILM  BAT54S  [SOT23]
IC20  TL431B  TL431  [SOT103P240X110-3N]
Q1  2N7002PS,115  [SC88]
Q2  2N7002PS,115  [SC88]
Q3  2N7002PS,115  [SC88]
Q4  2N7002PS,115  [SC88]
Q5  2N7002PS,115  [SC88]
R29  100R  R-EU_R0805  [R0805]
R30  470R  R-EU_R0805  [R0805]
R31  1K8  R-EU_R0805  [R0805]
R32  2K7  R-EU_R1206  [R1206]
R33  2K7  R-EU_R1206  [R1206]
R34  2K7  R-EU_R1206  [R1206]
R35  2K7  R-EU_R1206  [R1206]
R36  2K7  R-EU_R1206  [R1206]
R37  2K7  R-EU_R1206  [R1206]
R38  2K7  R-EU_R1206  [R1206]
R39  2K7  R-EU_R1206  [R1206]
R40  27K  R-EU_R0805  [R0805]
R41  27K  R-EU_R0805  [R0805]
R42  27K  R-EU_R0805  [R0805]
R43  27K  R-EU_R0805  [R0805]
R44  27K  R-EU_R0805  [R0805]
R45  27K  R-EU_R0805  [R0805]
R46  27K  R-EU_R0805  [R0805]
R47  27K  R-EU_R0805  [R0805]
R48  1K  R-EU_R0805  [R0805]
R49  1K  R-EU_R0805  [R0805]
R50  1K  R-EU_R0805  [R0805]
R51  1K  R-EU_R0805  [R0805]
R52  1K  R-EU_R0805  [R0805]
R53  1K  R-EU_R0805  [R0805]
R54  1K  R-EU_R0805  [R0805]
R55  1K  R-EU_R0805  [R0805]
X4  691322310008  [691322310008]

### Nets
+3V3_ISO: R29.1 ; also sheet 1,2,3,4,6
CLAMP: C75.1 C76.1 D15.2(C2) D16.2(C2) D17.2(C2) D18.2(C2) D19.2(C2) D20.2(C2) D21.2(C2) D22.2(C2) IC20.1(C) R29.2 R30.1 ; also sheet 6
DIN0: C77.1 C82.1 D15.3(C1A2) R32.2 R40.2 R48.1 ; also sheet 2
DIN1: C78.1 C83.1 D16.3(C1A2) R33.2 R41.2 R49.1 ; also sheet 2
DIN2: C79.1 D17.3(C1A2) R34.2 R42.2 R50.1 ; also sheet 2
DIN3: C84.1 D18.3(C1A2) R35.2 R43.2 R51.1 ; also sheet 2
DIN4: C80.1 D19.3(C1A2) R36.2 R44.2 R52.1 ; also sheet 2
DIN5: C85.1 D20.3(C1A2) R37.2 R45.2 R53.1 ; also sheet 2
DIN6: C81.1 D21.3(C1A2) R38.2 R46.2 R54.1 ; also sheet 2
DIN7/MISO: C86.1 D22.3(C1A2) R39.2 R47.2 R55.1 ; also sheet 2
GND: C75.2 C76.2 C77.2 C78.2 C79.2 C80.2 C81.2 C84.2 C85.2 C86.2 D15.1(A1) D16.1(A1) D17.1(A1) D18.1(A1) D19.1(A1) D20.1(A1) D21.1(A1) D22.1(A1) IC20.3(A) Q1.1(A:S) Q1.4(B:S) Q2.1(A:S) Q2.4(B:S) Q3.1(A:S) Q3.4(B:S) Q4.1(A:S) Q4.4(B:S) Q5.1(A:S) Q5.4(B:S) R31.2 R40.1 R41.1 R42.1 R43.1 R44.1 R45.1 R46.1 R47.1 ; also sheet 1,2,3,4,6
IN_CTRL0: Q1.2(A:G) ; also sheet 2
IN_CTRL1: Q1.5(B:G) ; also sheet 2
IN_CTRL2: Q2.2(A:G) ; also sheet 2
IN_CTRL3: Q2.5(B:G) ; also sheet 2
IN_CTRL4: Q3.2(A:G) ; also sheet 2
IN_CTRL5: Q3.5(B:G) ; also sheet 2
IN_CTRL6: Q4.2(A:G) ; also sheet 2
IN_CTRL7: Q4.5(B:G) ; also sheet 2
N$7: IC20.2(R) R30.2 R31.1
N$8: Q1.6(A:D) R48.2
N$9: Q1.3(B:D) R49.2
N$10: Q2.6(A:D) R50.2
N$13: Q2.3(B:D) R51.2
N$14: R33.1 X4.7
N$15: Q3.6(A:D) R52.2
N$16: Q3.3(B:D) R53.2
N$17: Q4.6(A:D) R54.2
N$23: Q4.3(B:D) R55.2
N$24: C82.2 Q5.6(A:D)
N$36: R32.1 X4.8
N$38: R34.1 X4.6
N$42: R35.1 X4.5
N$76: C83.2 Q5.3(B:D)
N$109: R36.1 X4.4
N$119: R38.1 X4.2
N$120: R39.1 X4.1
N$122: R37.1 X4.3
SLOW_DIN#0: Q5.2(A:G) ; also sheet 2
SLOW_DIN#1: Q5.5(B:G) ; also sheet 2

### Buses
DIN[0..6],DIN7/MISO
IN_CTRL[0..7]

### Notes on the sheet
- 16-pin input front panel connector
- AIN1+
- DIN1
- AIN1-/GND
- DIN2
- AIN2+
- DIN3
- AIN2-/GND
- Digital inputs, two ranges
- DIN4
- AIN3+
- DIN5
- AIN3-/GND
- DIN6
- AIN4+
- DIN7
- AIN4-/GND
- DIN8
- Licensed under the TAPR Open Hardware License (www.tapr.org/OHL)
- More info at http://www.envox.hr/eez
- Repository: https://github.com/eez-open

## Sheet 6 of 6: ADIB, PWM
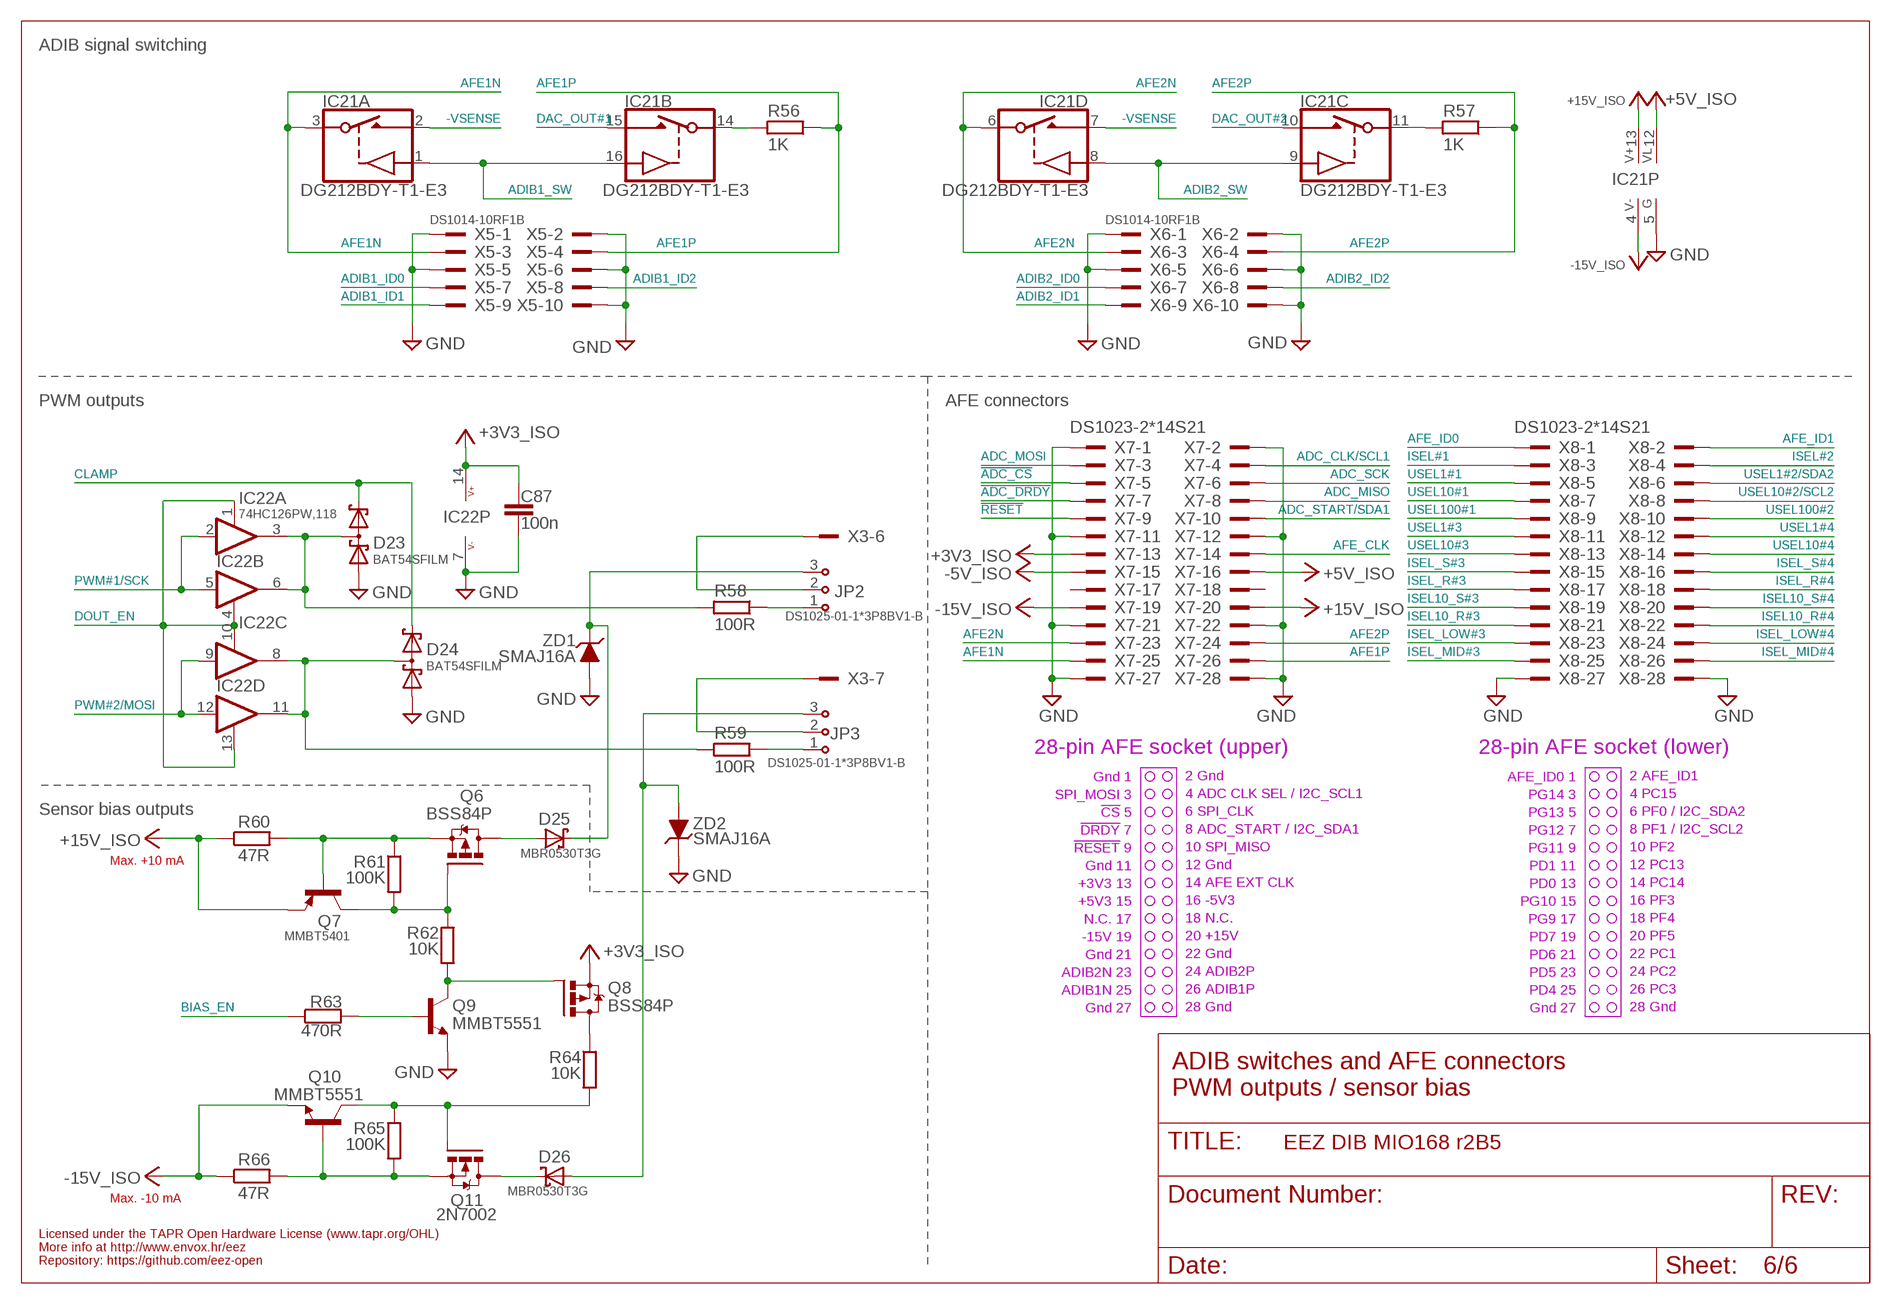
[diagram p5: schematic, sheet 6]

### Parts
C87  100n  C-EUC0603  [C0603]
D23  BAT54SFILM  BAT54S  [SOT23]
D24  BAT54SFILM  BAT54S  [SOT23]
D25  MBR0530T3G  SCHOTTKYSOD123  [SOD123]
D26  MBR0530T3G  SCHOTTKYSOD123  [SOD123]
IC21  DG212BDY-T1-E3  [SO16]
IC22  74HC126PW,118  [PW14]
JP2  DS1025-01-1*3P8BV1-B  JUMPER-3PIN2MM  [ZL303-03P]
JP3  DS1025-01-1*3P8BV1-B  JUMPER-3PIN2MM  [ZL303-03P]
Q6  BSS84P  IRLML2246TRPBF  [SOT95P237X112-3N]
Q7  MMBT5401  BC857B-PNP-SOT23-BEC  [SOT23-BEC]
Q8  BSS84P  IRLML2246TRPBF  [SOT95P237X112-3N]
Q9  MMBT5551  MMBT5551LT1-NPN-SOT23-BEC  [SOT23-BEC]
Q10  MMBT5551  MMBT5551LT1-NPN-SOT23-BEC  [SOT23-BEC]
Q11  2N7002  [SOT103P240X110-3N]
R56  1K  R-EU_R0805  [R0805]
R57  1K  R-EU_R0805  [R0805]
R58  100R  R-EU_R0805  [R0805]
R59  100R  R-EU_R0805  [R0805]
R60  47R  R-EU_R0805  [R0805]
R61  100K  R-EU_R0805  [R0805]
R62  10K  R-EU_R0805  [R0805]
R63  470R  R-EU_R0805  [R0805]
R64  10K  R-EU_R0805  [R0805]
R65  100K  R-EU_R0805  [R0805]
R66  47R  R-EU_R0805  [R0805]
X5  DS1014-10RF1B  [DS1014-10RF1B]
X6  DS1014-10RF1B  [DS1014-10RF1B]
X7  DS1023-2*14S21  TSW-114-07-F-D  [TSW-114-07-F-D]
X8  DS1023-2*14S21  TSW-114-07-F-D  [TSW-114-07-F-D]
ZD1  SMAJ16A  SMAJ-ADO214AC  [DO214AC]
ZD2  SMAJ16A  SMAJ-ADO214AC  [DO214AC]

### Nets
!ADC_CS: X7.5 ; also sheet 2
!ADC_DRDY: X7.7 ; also sheet 2
!RESET: X7.9 ; also sheet 1,2,4
+3V3_ISO: C87.2 IC22.14(P:V+) Q8.2(S) X7.13 ; also sheet 1,2,3,4,5
+5V_ISO: IC21.12(P:VL) X7.16 ; also sheet 1
+15V_ISO: IC21.13(P:V+) Q7.E R60.1 X7.20 ; also sheet 1,3,4
-5V_ISO: X7.15 ; also sheet 1
-15V_ISO: IC21.4(P:V-) Q10.E R66.1 X7.19 ; also sheet 1,3,4
-VSENSE: IC21.2(A:D) IC21.7(D:D) ; also sheet 3
ADC_CLK/SCL1: X7.4 ; also sheet 2
ADC_MISO: X7.8 ; also sheet 2
ADC_MOSI: X7.3 ; also sheet 2
ADC_SCK: X7.6 ; also sheet 2
ADC_START/SDA1: X7.10 ; also sheet 2
ADIB1_ID0: X5.7 ; also sheet 2
ADIB1_ID1: X5.9 ; also sheet 2
ADIB1_ID2: X5.8 ; also sheet 2
ADIB1_SW: IC21.1(A:IN) IC21.16(B:IN) ; also sheet 2
ADIB2_ID0: X6.7 ; also sheet 2
ADIB2_ID1: X6.9 ; also sheet 2
ADIB2_ID2: X6.8 ; also sheet 2
ADIB2_SW: IC21.8(D:IN) IC21.9(C:IN) ; also sheet 2
AFE1N: IC21.3(A:S) X5.3 X7.25
AFE1P: R56.1 X5.4 X7.26
AFE2N: IC21.6(D:S) X6.3 X7.23
AFE2P: R57.1 X6.4 X7.24
AFE_CLK: X7.14 ; also sheet 2
AFE_ID0: X8.1 ; also sheet 2
AFE_ID1: X8.2 ; also sheet 2
BIAS_EN: R63.1 ; also sheet 2
CLAMP: D23.2(C2) D24.2(C2) ; also sheet 5
DAC_OUT#1: IC21.15(B:D) ; also sheet 3
DAC_OUT#2: IC21.10(C:D) ; also sheet 3
DOUT_EN: IC22.1(A:EN) IC22.4(B:EN) IC22.10(C:EN) IC22.13(D:EN) ; also sheet 2,4
GND: C87.1 D23.1(A1) D24.1(A1) IC21.5(P:GND) IC22.7(P:V-) Q9.E X5.1 X5.2 X5.5 X5.6 X5.10 X6.1 X6.2 X6.5 X6.6 X6.10 X7.1 X7.2 X7.11 X7.12 X7.21 X7.22 X7.27 X7.28 X8.27 X8.28 ZD1.A ZD2.C ; also sheet 1,2,3,4,5
ISEL10_R#3: X8.21 ; also sheet 2
ISEL10_R#4: X8.22 ; also sheet 2
ISEL10_S#3: X8.19 ; also sheet 2
ISEL10_S#4: X8.20 ; also sheet 2
ISEL#1: X8.3 ; also sheet 2
ISEL#2: X8.4 ; also sheet 2
ISEL_LOW#3: X8.23 ; also sheet 2
ISEL_LOW#4: X8.24 ; also sheet 2
ISEL_MID#3: X8.25 ; also sheet 2
ISEL_MID#4: X8.26 ; also sheet 2
ISEL_R#3: X8.17 ; also sheet 2
ISEL_R#4: X8.18 ; also sheet 2
ISEL_S#3: X8.15 ; also sheet 2
ISEL_S#4: X8.16 ; also sheet 2
N$3: Q9.B R63.2
N$4: JP2.1 R58.1
N$6: JP3.1 R59.1
N$20: IC21.14(B:S) R56.2
N$22: IC21.11(C:S) R57.2
N$25: JP2.2 X3.6
N$39: JP3.2 X3.7
N$129: D23.3(C1A2) IC22.3(A:O) IC22.6(B:O) R58.2
N$134: D24.3(C1A2) IC22.8(C:O) IC22.11(D:O) R59.2
N$149: Q8.1(G) Q9.C R62.2
N$151: Q6.1(G) Q7.C R61.2 R62.1
N$152: D25.A Q6.3(D)
N$153: D25.C JP2.3 ZD1.C
N$154: Q6.2(S) Q7.B R60.2 R61.1
N$155: Q10.C Q11.1(G) R64.2 R65.1
N$162: Q10.B Q11.2(S) R65.2 R66.2
N$163: Q8.3(D) R64.1
N$164: D26.C Q11.3(D)
N$168: D26.A JP3.3 ZD2.A
PWM#1/SCK: IC22.2(A:I) IC22.5(B:I) ; also sheet 2
PWM#2/MOSI: IC22.9(C:I) IC22.12(D:I) ; also sheet 2
USEL1#1: X8.5 ; also sheet 2
USEL1#2/SDA2: X8.6 ; also sheet 2
USEL1#3: X8.11 ; also sheet 2
USEL1#4: X8.12 ; also sheet 2
USEL10#1: X8.7 ; also sheet 2
USEL10#2/SCL2: X8.8 ; also sheet 2
USEL10#3: X8.13 ; also sheet 2
USEL10#4: X8.14 ; also sheet 2
USEL100#1: X8.9 ; also sheet 2
USEL100#2: X8.10 ; also sheet 2
Unconnected: X7.17 X7.18

### Notes on the sheet
- ADIB signal switching
- PWM outputs | AFE connectors
- 28-pin AFE socket (upper) | 28-pin AFE socket (lower)
- Gnd 1 | AFE_ID0 1
- 2 Gnd | 2 AFE_ID1
- SPI_MOSI 3 | PG14 3
- 4 ADC CLK SEL / I2C_SCL1 | 4 PC15
- Sensor bias outputs
- !CS! 5 | PG13 5
- 6 SPI_CLK | 6 PF0 / I2C_SDA2
- !DRDY! 7 | PG12 7
- 8 ADC_START / I2C_SDA1 | 8 PF1 / I2C_SCL2
- !RESET! 9 | PG11 9
- 10 SPI_MISO | 10 PF2
- Gnd 11 | PD1 11
- Max. +10 mA
- 12 Gnd | 12 PC13
- +3V3 13 | PD0 13
- 14 AFE EXT CLK | 14 PC14
- +5V3 15 | PG10 15
- 16 -5V3 | 16 PF3
- N.C. 17 | PG9 17
- 18 N.C. | 18 PF4
- -15V 19 | PD7 19
- 20 +15V | 20 PF5
- Gnd 21 | PD6 21
- 22 Gnd | 22 PC1
- ADIB2N 23 | PD5 23
- 24 ADIB2P | 24 PC2
- ADIB1N 25 | PD4 25
- 26 ADIB1P | 26 PC3
- Gnd 27 | Gnd 27
- 28 Gnd | 28 Gnd
- ADIB switches and AFE connectors
  PWM outputs / sensor bias
- Max. -10 mA
- Licensed under the TAPR Open Hardware License (www.tapr.org/OHL)
- More info at http://www.envox.hr/eez
- Repository: https://github.com/eez-open

## Library data of the parts
C1-C26 C28-C87 = rcl:C-EU: CAPACITOR, European symbol
C27 = EEZ_Lib1:ECAP
D1-D10 D25 D26 = EEZ_Lib1:SCHOTTKY
D11-D24 = diode:BAT54S: Schottky Diodes Pin connection corrected 2011-05-04 Source: Fairchild .. BAT54.pdf
FM1-FM3 = EEZ_Lib1:FIDUCIAL: Fiducial mark for pick and place automation
IC1 = EEZ_Lib1:AT24CXX: I2C-Compatible (2-wire) Serial EEPROM
IC2 IC3 = EEZ_Lib1:SI8641: Low power 4-ch digital isolator (3+1) Farnell: 2423288
IC4 = EEZ_DIB:LP2985: 150-mA Low-noise Low-dropout Regulator With Shutdown
IC5 = EEZ_Lib1:MC78LXX: μA78L00 series positive voltage regulators
IC6 = EEZ_TI:SN6505B: Low-Noise 1A Transformer Drivers for Isolated Power Supplies
IC7 = EEZ_Lib1:MC79LXX: 3-terminal negative voltage regulator, up to 100mA
IC8 = EEZ_DIB:STM32F446
IC9 = EEZ_DIB:XTSD0XG: SD NAND
IC10 IC15 = EEZ_Lib1:TL072
IC11 IC12 = EEZ_TI:DAC7760: Single-Channel, 12-Bit Programmable Current and Voltage Output DAC for 4-mA to 20-mA Current Loop Applications
IC13 = EEZ_TI:OPA376A: Low-Noise, Low Quiescent Current, Precision Operational Amplifier
IC14 = EEZ_TI:DAC7563: Dual 12-Bit, Low-Power, Buffered, Voltage-Output DAC With 2.5-V, 4-PPM/°C Internal Reference
IC16-IC19 = EEZ_Lib1:BTS3408G: Smart Dual Low-side Power Switch
IC20 = EEZ_Lib1:TL431: Precision programmable reference
IC21 = EEZ_DIB:DG212B: Improved Quad CMOS Analog Switches
IC22 = EEZ_DIB:74HC126: Quad buffer/line driver; 3-state
J1 = EEZ_connectors:PCB_TAB: PCB quick-fit terminal
J2 = EEZ_Lib1:5033981892: SD Micro connector; push-push; SMT; gold plated
JP1 = EEZ_Lib1:JP3-CUT
JP2 JP3 = EEZ_connectors:JUMPER-3PIN
KK1 KK2 = EEZ_Lib1:PCB-MB: Richo Mounting Block; 16 x 6 mm
L1 = EEZ_inductors_and_transformers:SRF0905: Bourns SRF0905 Series - Line Filter
L2-L7 = EEZ_Lib1:FERRITE_BEAD: FAIR-RITE - 2506033007Y3 - FERRITE BEAD, 0.04OHM, 3A, 0603 Farnell: 2112873
Q1-Q5 = EEZ_DIB:2N7002PS: Dual 60 V, 320 mA N-channel Trench MOSFET
Q6 Q8 = EEZ_Lib1:IRLML2246TRPBF: HEXFET Power MOSFET (-20V, -2.6A); MPN: IRLML2246TRPBF; OC_FARNELL: 1888166; OC_NEWARK: 40T7450; PACKAGE: SOT-3; SUPPLIER: International Rectifier; TME: IRLML2246TRPBF
Q7 = transistor:*-PNP-: PNP Transistror
Q9 Q10 = transistor:*-NPN-: NPN Transistror BF959 corrected 2008.03.06
Q11 = EEZ_Lib1:2N7002: N-CHANNEL ENHANCEMENT MODE FIELD EFFECT TRANSISTOR; MPN: 2N7002-7-F; OC_FARNELL: 1713823; OC_NEWARK: 25R5679; PACKAGE: SOT-23-3; SUPPLIER: DIODES INC.
R1-R66 = rcl:R-EU_: RESISTOR, European symbol
RN1-RN6 = EEZ_Lib1:R_ARRAY4: 1206 four resistor array
SH1 SH2 = EEZ_Lib1:SHORT
TP1 = EEZ_Lib1:PCB_TEST_TAB
TR1 = EEZ_inductors_and_transformers:MURATA_78615: General Purpose Pulse Transformers
TVS1-TVS4 = EEZ_Lib1:PESDXL1BA: Low capacitance bidirectional ESD protection diodes
X1 = EEZ_connectors:77317-104-28LF: Headers & Wire Housings 28P right angle 0.1" pitch
X2 = con-samtec:SSW-106-02-S-S: THROUGH-HOLE .025" SQ POST SOCKET Source: Samtec SSW.pdf; MPN: SSW-106-02-S-S; OC_FARNELL: unknown; OC_NEWARK: 11P9416
X3 = EEZ_connectors:691327310016: WR-TBL Serie 3273 – 3.81mm Close Horizontal Dual Row PCB Header, 16 Pins
X4 = EEZ_connectors:691322310008: WR-TBL Serie 322 - 3.81mm Vertical PCB Header, 8 Pins
X5 X6 = EEZ_connectors:DS1014-10RF1B: 10-pin IDC 2mm Socket; male; 90°; THT
X7 X8 = EEZ_connectors:TSW-114-07-F-D: Samtec TSW Header, 2.54MM, THT, 28-way
Y1 = EEZ_Lib1:12SMX-B
ZD1 ZD2 = EEZ_Lib1:SMAJ-A

## Net classes
0 default: width 0.152 mm, drill 0.3 mm, clearance 0.152 mm
1 lvds: width 0.152 mm, drill 0.3 mm, clearance 0.152 mm to class 0, clearance 0.152 mm
2 gnd: width 0.254 mm, drill 0.584 mm, clearance 0.254 mm
3 diff_in: width 0.254 mm, drill 0.584 mm, clearance 0.203 mm to class 0, clearance 0.203 mm to class 1, clearance 0.203 mm to class 2, clearance 0.203 mm